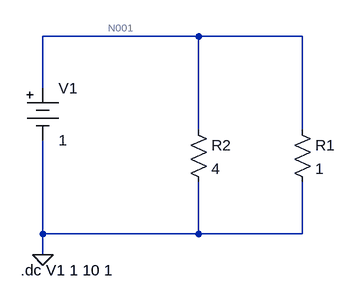
[diagram p0: schematic s-311_2.asc]
s-311_2.asc, the LTspice schematic file:
Version 4
SHEET 1 880 680
WIRE 304 48 64 48
WIRE 464 48 304 48
WIRE 64 128 64 48
WIRE 304 192 304 48
WIRE 464 192 464 48
WIRE 64 352 64 208
WIRE 304 352 304 272
WIRE 304 352 64 352
WIRE 464 352 464 272
WIRE 464 352 304 352
WIRE 64 384 64 352
FLAG 64 384 0
SYMBOL res 448 176 R0
SYMATTR InstName R1
SYMATTR Value 1
SYMBOL res 288 176 R0
SYMATTR InstName R2
SYMATTR Value 4
SYMBOL Misc\\battery 64 112 R0
WINDOW 123 0 0 Left 0
WINDOW 39 0 0 Left 0
SYMATTR InstName V1
SYMATTR Value 1
TEXT 30 408 Left 2 !.dc V1 1 10 1

The netlist it stands for:
* s-311_2.asc
R1 N001 0 1
R2 N001 0 4
V1 N001 0 1
.dc V1 1 10 1
.backanno
.end

* Results of the author's LTspice run, read from the files saved beside the schematic
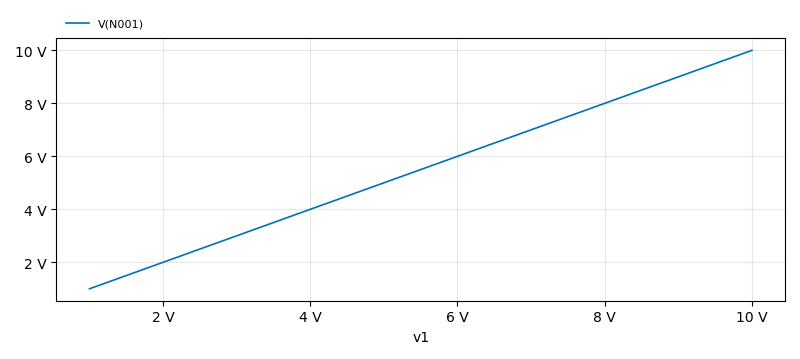
[diagram p1: DC transfer characteristic of s-311_2.asc, plotted from the saved traces]
* DC transfer characteristic, 1 run:
*   V(N001): 1 V at v1=1 V, 10 V at v1=10 V, min 1 V, max 10 V